# EasyEDA schematic SCH_trail_2024-05-24.json
TITLE: Sheet_1; REV: 1.0; Date: 2024-05-19; Sheet: 1/1; Drawn By: ha46; Company: Your Company
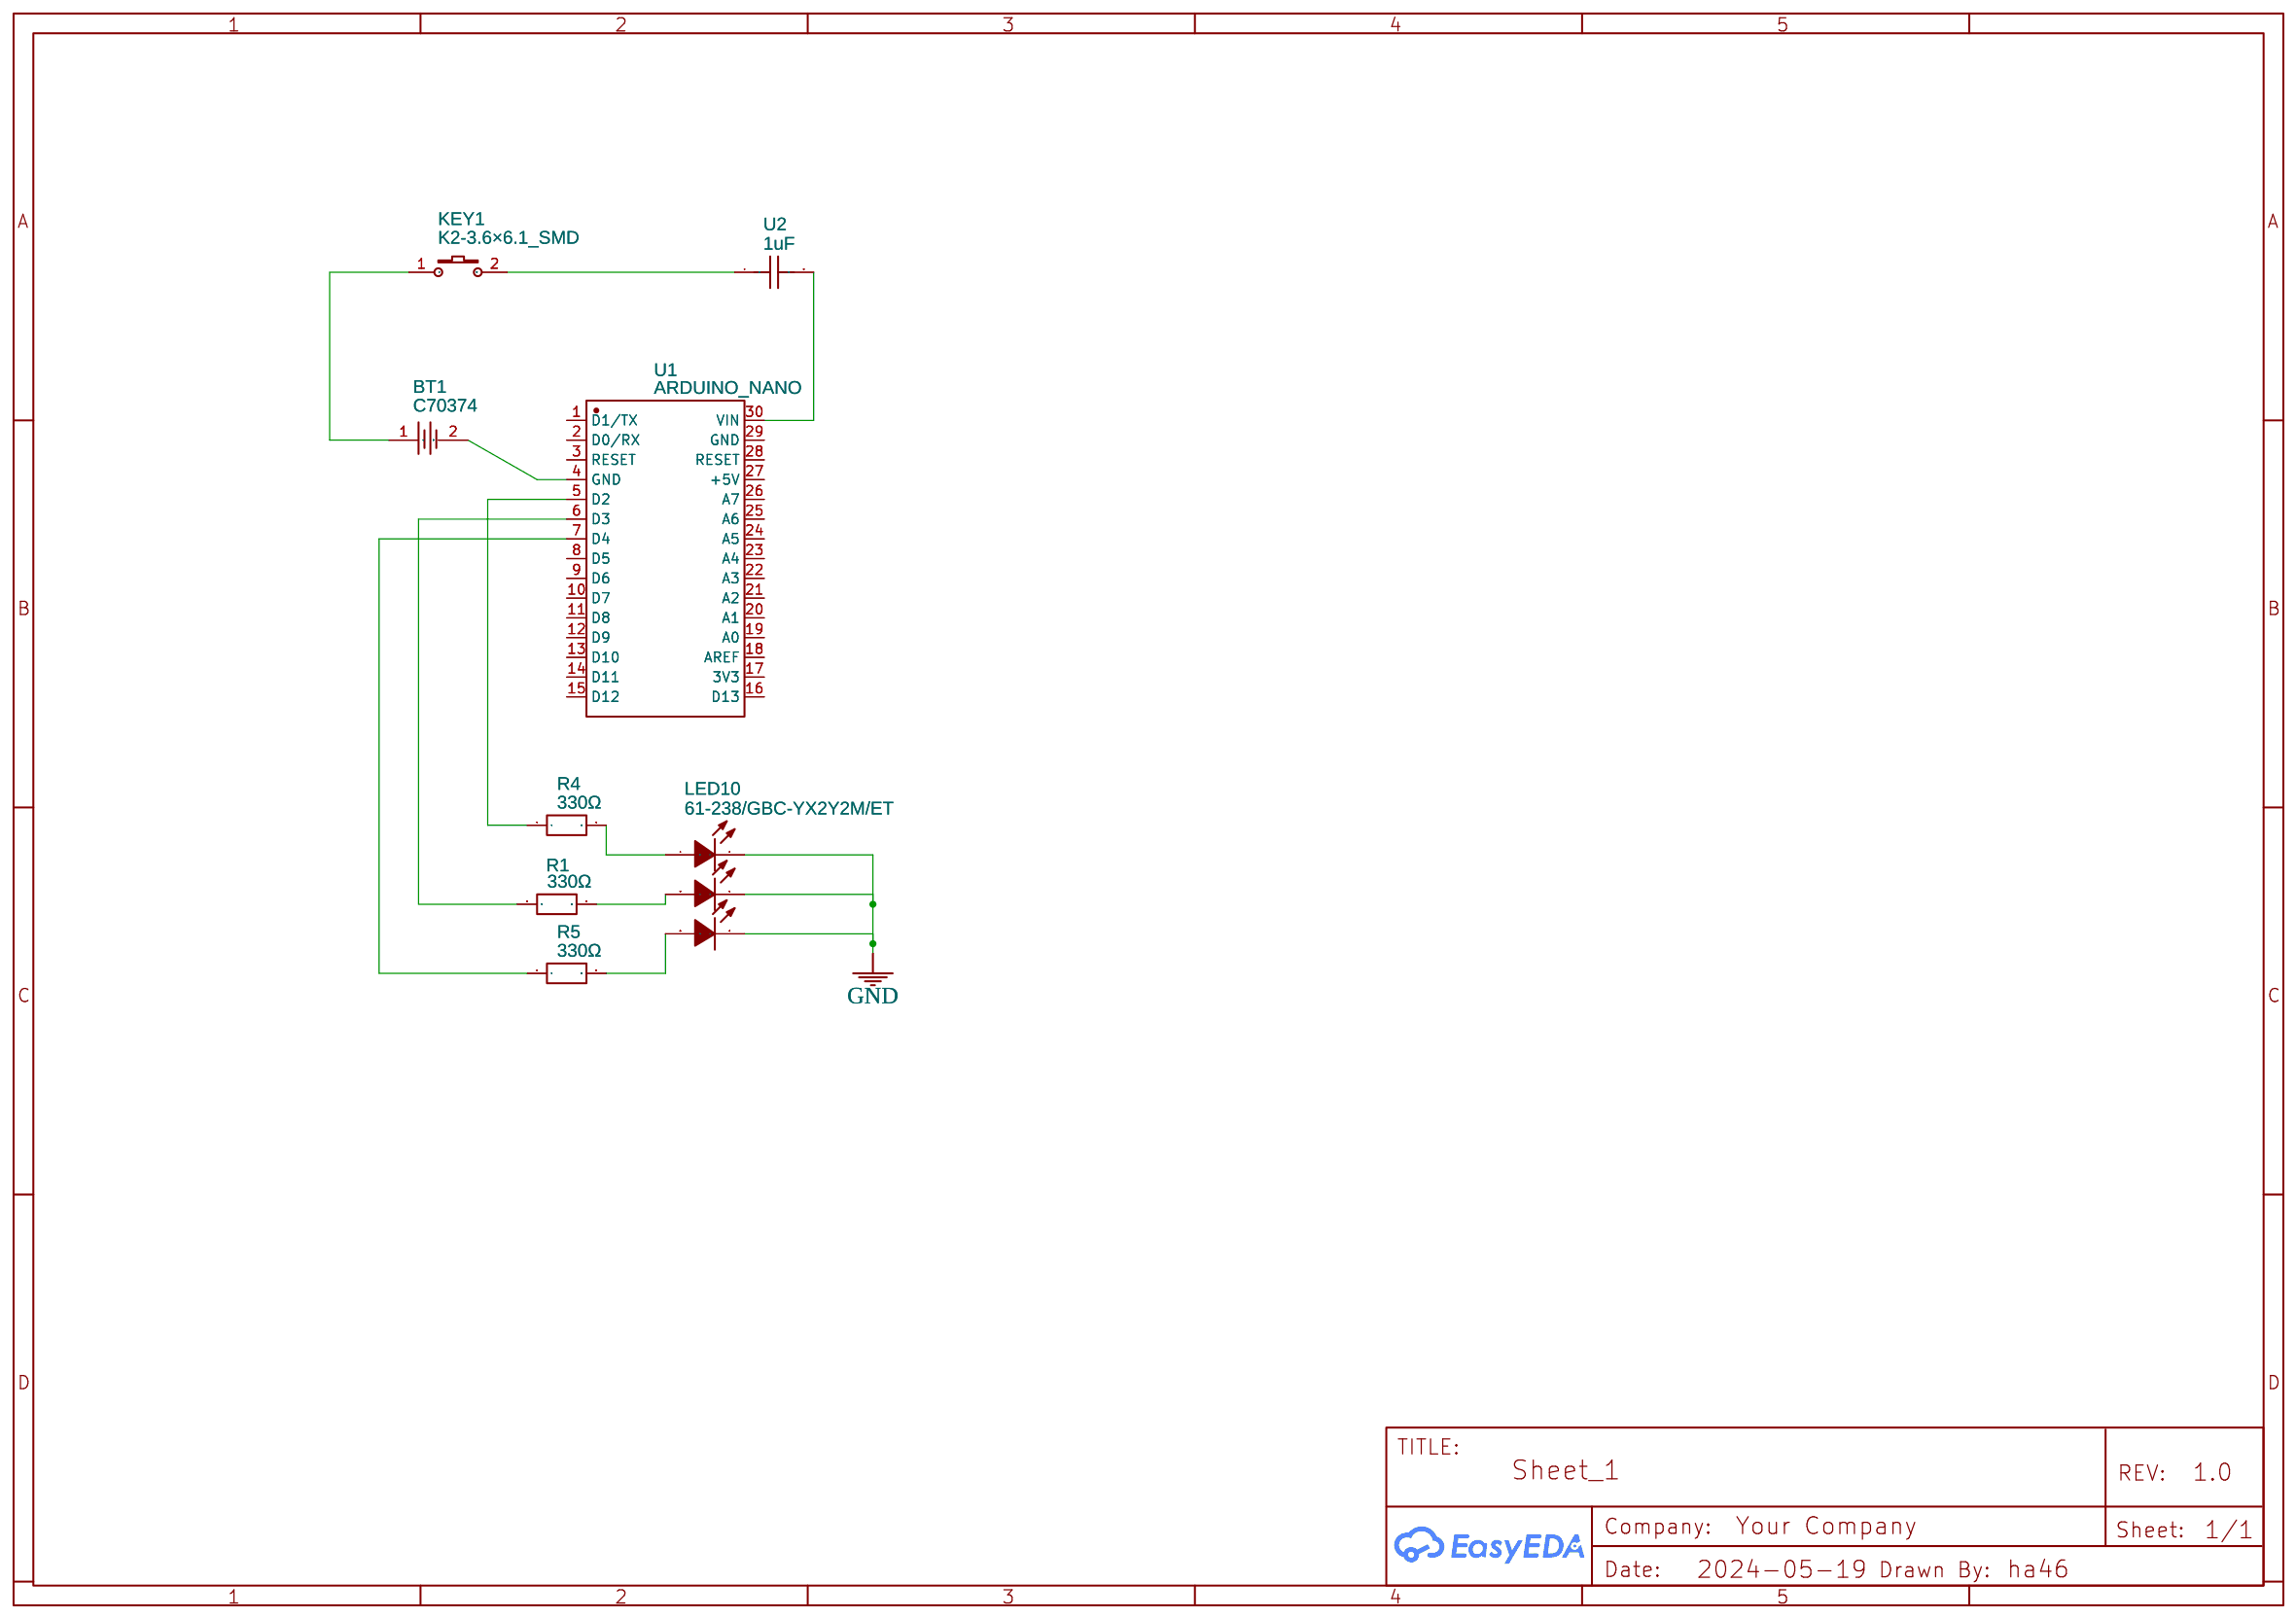
[diagram p0: schematic sheet]

## Parts
BT1  C70374  [BATT_TERM]
KEY1  K2-3.6×6.1_SMD  [KEY-SMD_2P-L6.2-W3.6-LS8.0]
LED10  61-238/GBC-YX2Y2M/ET  [LED-ARRAY-SMD_6P-L5.0-W5.0-BL-RD]
R1  330Ω  [R0805]
R4  330Ω  [R0805]
R5  330Ω  [R0805]
U1  ARDUINO_NANO  [COMM-TH_ARDUINO_NANO]
U2  1uF  [C0603]

## Library data of the parts
BT1 = C70374: Manufacturer: Q&J; Supplier: LCSC; Contributor: lukesj2011
KEY1 = K2-3.6×6.1_SMD: Supplier Part: C118141; Supplier: LCSC; Manufacturer Part: K2-1107ST-A4SW-06; Contributor: LCEDA_Lib; 制造商: 韩国韩荣
LED10 = 61-238/GBC-YX2Y2M/ET: Contributor: LCSC; Supplier: LCSC; Supplier Part: C431970; Manufacturer: EVERLIGHT(亿光); JLCPCB Part Class: Extended Part
R1 R4 R5 = CR0805J330RP05Z: Contributor: LCSC; Supplier: LCSC; Supplier Part: C881004; Manufacturer: EVER OHMS(天二科技); JLCPCB Part Class: Extended Part
U1 = ARDUINO_NANO: Contributor: lcsc; Supplier: LCSC; Supplier Part: C9900017879; Manufacturer: null; JLCPCB Part Class: Extended Part
U2 = CS1608Y5V105Z160NRB: Supplier: LCSC; Supplier Part: C5189821; Manufacturer: SAMWHA(三和); Contributor: lcsc

## Nets
GND: LED10.1(-) LED10.2(-) LED10.3(-)
Net-(BT1-1): BT1.1 KEY1.1
Net-(BT1-2): BT1.2 U1.4(GND)
Net-(KEY1-2): KEY1.2 U2.1
Net-(LED10-4): LED10.4(+) R4.2
Net-(LED10-5): LED10.5(+) R1.2
Net-(LED10-6): LED10.6(+) R5.2
Net-(R1-1): R1.1 U1.6(D3)
Net-(R4-1): R4.1 U1.5(D2)
Net-(R5-1): R5.1 U1.7(D4)
Net-(U1-30): U1.30(VIN) U2.2

Not connected (* = marked no-connect by the designer): U1 1(D1/TX) 2(D0/RX) 3(RESET) 8(D5) 9(D6) 10(D7) 11(D8) 12(D9) 13(D10) 14(D11) 15(D12) 16(D13) 17(3V3) 18(AREF) 19(A0) 20(A1) 21(A2) 22(A3) 23(A4) 24(A5) 25(A6) 26(A7) 27(+5V) 28(RESET) 29(GND)
